# EAGLE design Steering Wheel LED Right (EAGLE 7.2.0)
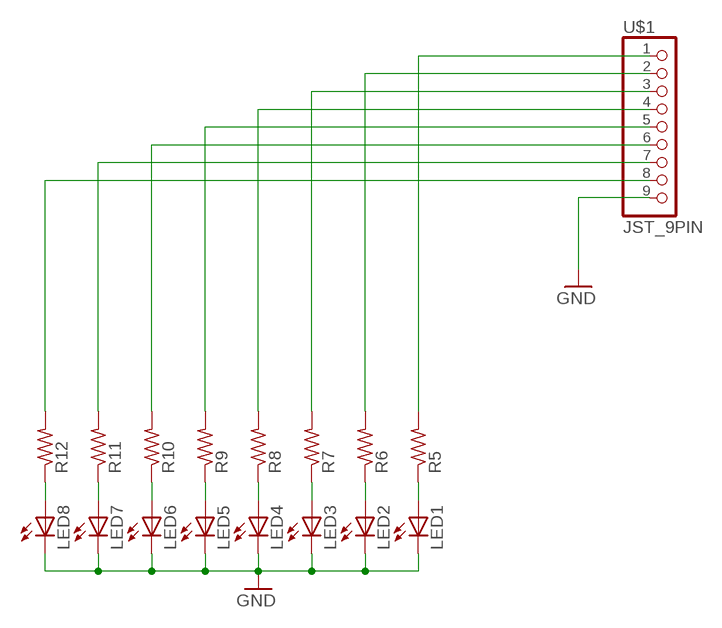
[diagram p0: schematic, sheet 1]

## Parts
LED1  LED3MM  [LED3MM]
LED2  LED3MM  [LED3MM]
LED3  LED3MM  [LED3MM]
LED4  LED3MM  [LED3MM]
LED5  LED3MM  [LED3MM]
LED6  LED3MM  [LED3MM]
LED7  LED3MM  [LED3MM]
LED8  LED3MM  [LED3MM]
R5  R-US_M1206  [M1206]
R6  R-US_M1206  [M1206]
R7  R-US_M1206  [M1206]
R8  R-US_M1206  [M1206]
R9  R-US_M1206  [M1206]
R10  R-US_M1206  [M1206]
R11  R-US_M1206  [M1206]
R12  R-US_M1206  [M1206]
U$1  JST_9PIN  [JST-PH-9-THM]

## Nets
GND: LED1.K(C) LED2.K(C) LED3.K(C) LED4.K(C) LED5.K(C) LED6.K(C) LED7.K(C) LED8.K(C) U$1.9
N$2: LED3.A R7.1
N$3: LED2.A R6.1
N$4: LED1.A R5.1
N$5: LED4.A R8.1
N$6: LED5.A R9.1
N$7: LED6.A R10.1
N$8: LED7.A R11.1
N$9: LED8.A R12.1
N$10: R10.2 U$1.6
N$11: R5.2 U$1.1
N$12: R6.2 U$1.2
N$13: R7.2 U$1.3
N$14: R8.2 U$1.4
N$15: R9.2 U$1.5
N$16: R11.2 U$1.7
N$17: R12.2 U$1.8

## Library data of the parts
LED1-LED8 = adafruit:LED: LED OSRAM: - CHIPLED LG R971, LG N971, LY N971, LG Q971, LY Q971, LO R971, LY R971 LH N974, LH R974 LS Q976, LO Q976, LY Q976 LO Q996 - Hyper CHIPLED LW Q18S LB Q993, LB Q99A, LB R99A - SideLED LS A670, LO A670, LY A670, LG A670, LP A670 LB A673, LV A673, LT A673, LW A673 LH A674 LY A675 LS A676, LA A676, LO A676, LY A676, LW A676 LS A679, LY A679, LG A679 - Hyper Micro SIDELED® LS Y876, LA Y876, LO Y876, LY Y876 LT Y87S - SmartLED LW L88C, LW L88S LB L89C, LB L89S, LG L890 LS L89K, LO L89K, LY L89K LS L896, LA L896, LO L896, LY L896 - TOPLED LS T670, LO T670, LY T670, LG T670, LP T670 LSG T670, LSP T670, LSY T670, LOP T670, LYG T670 LG T671, LOG T671, LSG T671 LB T673, LV T673, LT T673, LW T673 LH T674 LS T676, LA T676, LO T676, LY T676, LB T676, LH T676, LSB T676, LW T676 LB T67C, LV T67C, LT T67C, LS T67K, LO T67K, LY T67K, LW E67C LS E67B, LA E67B, LO E67B, LY E67B, LB E67C, LV E67C, LT E67C LW T67C LS T679, LY T679, LG T679 LS T770, LO T770, LY T770, LG T770, LP T770 LB T773, LV T773, LT T773, LW T773 LH T774 LS E675, LA E675, LY E675, LS T675 LS T776, LA T776, LO T776, LY T776, LB T776 LHGB T686 LT T68C, LB T68C - Hyper Mini TOPLED® LB M676 - Mini TOPLED Santana® LG M470 LS M47K, LO M47K, LY M47K Source: http://www.osram.convergy.de/
R5-R12 = adafruit:R-US_: RESISTOR, American symbol
U$1 = adafruit:JST_9PIN

## Board
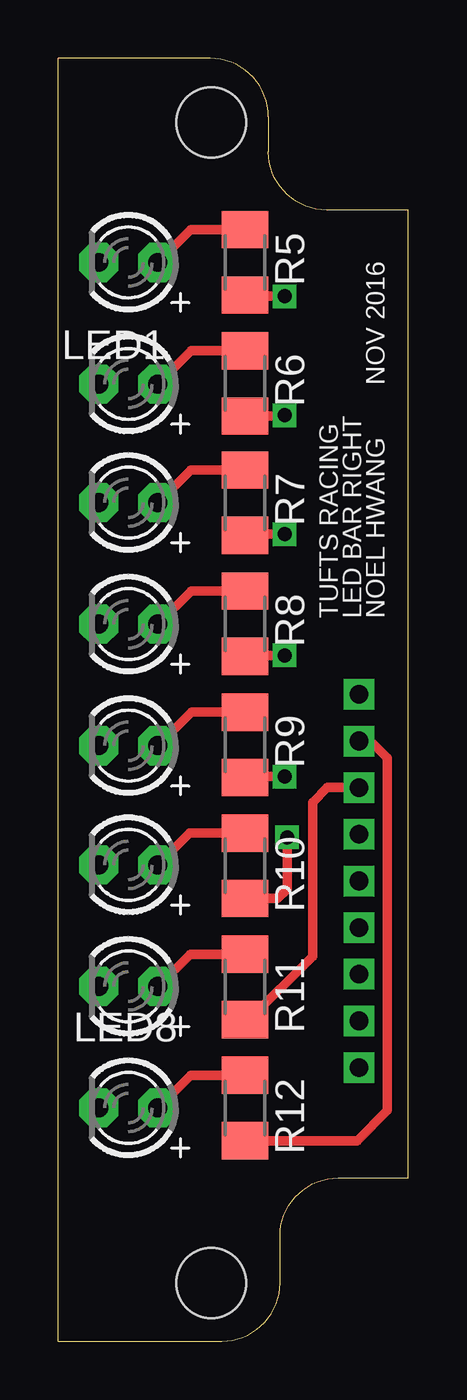
[diagram p1: board, top side]
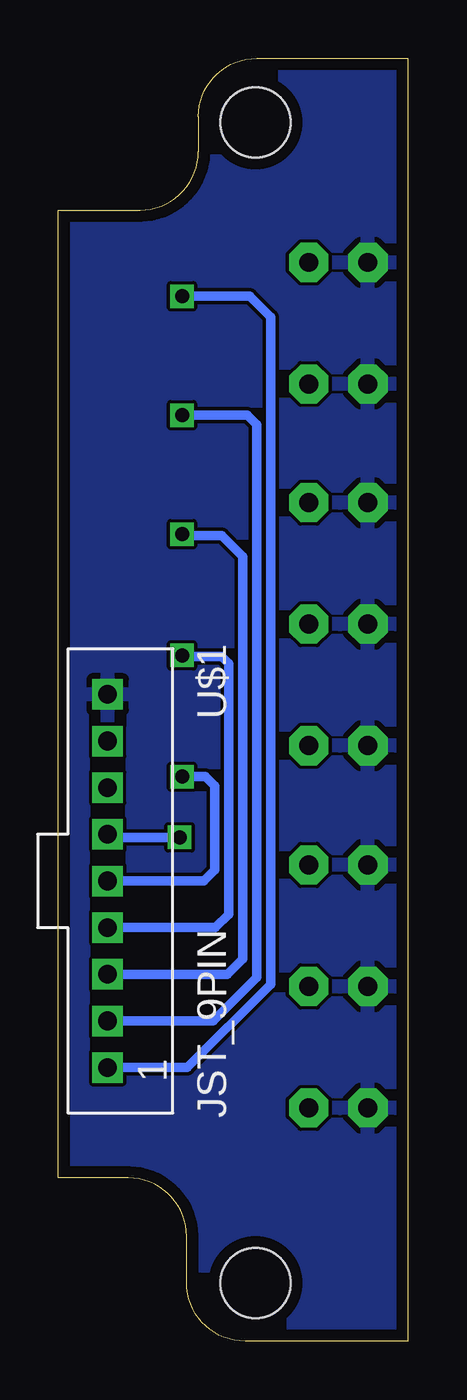
[diagram p2: board, bottom side, seen from below]

Size 15 x 55 mm. Coordinates in mm from the lower left corner, seen from the top.
Outline: 0,0 0,55 6.5,55 arc-90 9,52.5 9,51 arc90 11.5,48.5 15,48.5 15,7 12,7 arc90 9.5,4.5 9.5,2.5 arc-90 7,0 0,0
Copper layers (1*16): Top 0.035mm / dielectric 1.5mm / Bottom 0.035mm
Design rules "3pcb": minimum track width 6mil, minimum drill 8mil, track to track 6mil, track to pad 6mil, pad to pad 6mil, via to via 6mil, smd to smd 6mil, copper to edge 20mil, drill to drill 6mil, minimum pad ring 10mil, minimum via ring 8mil, stop-mask expansion 4mil, vias tented up to drill 0mil, thermal gap 10mil
Holes 3 mm at 6.55,2.49 6.55,52.25

### Footprints (pad centres in the part's own frame; a part is rotated, then mirrored left to right if it is on the bottom)
LED3MM = drill 0.813 pad 1.676 octagon: A -1.27,0; K 1.27,0
M1206 = smd 1.6 x 2: 1 -1.4,0; 2 1.4,0
JST-PH-9-THM = drill 0.8 square: 1 8,0; 2 6,0; 3 4,0; 4 2,0; 5 0,0; 6 -2,0; 7 -4,0; 8 -6,0; 9 -8,0

### Placement (x,y rotation side)
LED1  3,46.25 180 top
LED2  3,41.04 180 top
LED3  3,35.95 180 top
LED4  3,30.74 180 top
LED5  3,25.53 180 top
LED6  3,20.42 180 top
LED7  3,15.21 180 top
LED8  3,10 180 top
R5  8,46.25 270 top
R6  8,41.06 270 top
R7  8,35.95 270 top
R8  8,30.76 270 top
R9  8,25.57 270 top
R10  8,20.38 270 top
R11  8,15.19 270 top
R12  8,10 270 top
U$1  12.89,19.73 270 bottom

### Tracks (layer width: path | path; a pad name or v marks a point on that pad's centre or on a via)
GND
  pour Bottom: 17,55 0,55 0,0 17,0
N$2
  Top 0.406: R7.1 5.67,37.35 LED3.A
N$3
  Top 0.406: R6.1 5.69,42.46 LED2.A
N$4
  Top 0.406: R5.1 5.67,47.65 LED1.A
N$5
  Top 0.406: R8.1 5.69,32.16 LED4.A
N$6
  Top 0.406: R9.1 5.71,26.97 LED5.A
N$7
  Top 0.406: R10.1 5.63,21.78 LED6.A
N$8
  Top 0.406: R11.1 5.65,16.59 LED7.A
N$9
  Top 0.406: R12.1 5.67,11.4 LED8.A
N$10  (via drill 0.6)
  Top 0.406: R10.2 9.38,18.98 9.8,19.4 v9.8,21.6
  Bottom 0.406: v9.8,21.6 12.76,21.6 U$1.6
N$11  (via drill 0.6)
  Top 0.406: v9.7,44.8 8.05,44.8 R5.2
  Bottom 0.406: U$1.1 9.47,11.73 5.9,15.3 5.9,43.9 6.8,44.8 v9.7,44.8
N$12  (via drill 0.6)
  Top 0.406: R6.2 9.66,39.66 v9.7,39.7
  Bottom 0.406: v9.7,39.7 6.9,39.7 6.5,39.3 6.5,15.6 8.37,13.73 U$1.2
N$13  (via drill 0.6)
  Top 0.406: v9.7,34.6 8.05,34.6 R7.2
  Bottom 0.406: U$1.3 7.77,15.73 7.1,16.4 7.1,33.65 R7.2 9.55,34.55 v9.7,34.6
N$14  (via drill 0.6)
  Top 0.406: v9.7,29.4 8.04,29.4 R8.2
  Bottom 0.406: U$1.4 8.27,17.73 7.7,18.3 7.7,29.06 R8.2 9.76,29.36 v9.7,29.4
N$15  (via drill 0.6)
  Top 0.406: v9.7,24.2 8.03,24.2 R9.2
  Bottom 0.406: U$1.5 8.77,19.73 8.3,20.2 8.3,23.8 8.7,24.2 v9.7,24.2
N$16
  Top 0.406: R11.2 8.19,13.79 10.9,16.5 10.9,23.1 11.53,23.73 U$1.7
N$17
  Top 0.406: U$1.8 13.37,25.73 14.1,25 14.1,9.9 12.8,8.6 R12.2

### Text on the board
tNames: NOV 2016 | TUFTS RACING | LED BAR RIGHT | NOEL HWANG